# Altium schematic sheet Power Supply.SchDoc: Power supply Unit
size A; SheetNumber: 4; SheetTotal: 4
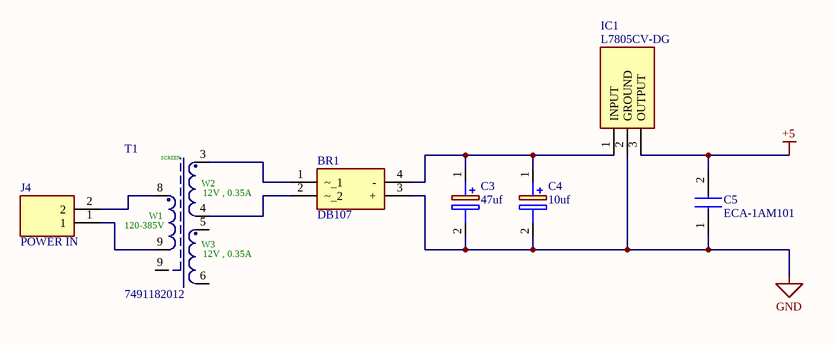
[diagram p0: Power Supply.SchDoc]

## Parts
BR1  DB107  [DIP825W50P510L830H340Q4N]
C3  47uf  [CAPPRD250W55D630H1220]
C4  10uf  [CAPPRD200W55D500H1200]
C5  ECA-1AM101  [CAPPRD200W55D525H1200]
IC1  L7805CV-DG  [TO255P460X1020X2008-3P]
J4  POWER IN  [TB00250002BE]
T1  7491182012  [EE16_7_4 (E16)]

## Nets
+5: C5.2(-) IC1.3(OUTPUT)
GND: BR1.3(+) C3.2(-) C4.2(-) C5.1(+) IC1.2(GROUND)
NetBR1_1: BR1.1(~_1) T1.3
NetBR1_2: BR1.2(~_2) T1.4
NetBR1_4: BR1.4(-) C3.1(+) C4.1(+) IC1.1(INPUT)
NetJ4_1: J4.1 T1.9
NetJ4_2: J4.2 T1.8

Not connected (* = marked no-connect by the designer): T1 5 6

## Notes on the sheet
- (in symbol CMP-1471-00001-1) SCREEN; W2; 12V , 0.35A; W1; 120-385V; W3

## Library data of the parts
BR1 = DB107: Bridge Rectifier; Manufacturer_Name: Rectron; Datasheet Link: https://www.rectron.com/data_sheets/db101-107.pdf; Height: 3.4mm; Manufacturer_Part_Number: DB107; Mouser Part Number: 583-DB107; Mouser Price/Stock: https://www.mouser.co.uk/ProductDetail/Rectron/DB107?qs=G5AQjGfRJcLGAY%252B6bEDnbw%3D%3D
C3 = ECE-A1EN470UB: Capacitor Polarised; Manufacturer_Name: Panasonic; Datasheet Link: http://industrial.panasonic.com/cdbs/www-data/pdf/RDF0000/ABA0000C1053.pdf; Height: 12.2mm; Manufacturer_Part_Number: ECE-A1EN470UB; Mouser Part Number: 667-ECE-A1EN470UB; Mouser Price/Stock: https://www.mouser.co.uk/ProductDetail/Panasonic/ECE-A1EN470UB?qs=rMMd5vBiahp%252B1Xr0dP1Lmg%3D%3D
C4 = ECA-1EM100: Capacitor Polarised; Manufacturer_Name: Panasonic; Datasheet Link: https://componentsearchengine.com/Datasheets/2/ECA-1EM100.pdf; Height: 12mm; Manufacturer_Part_Number: ECA-1EM100; Mouser Part Number: 667-ECA-1EM100; Mouser Price/Stock: https://www.mouser.com/Search/Refine.aspx?Keyword=667-ECA-1EM100; Arrow Part Number: ECA-1EM100; Arrow Price/Stock: https://www.arrow.com/en/products/eca1em100/panasonic
C5 = ECA-1AM101: Capacitor; Manufacturer_Name: Panasonic; Datasheet Link: http://uk.rs-online.com/web/p/products/8073233; Height: 12mm; Manufacturer_Part_Number: ECA-1AM101; Mouser Part Number: 667-ECA-1AM101; Mouser Price/Stock: https://www.mouser.co.uk/ProductDetail/Panasonic/ECA-1AM101?qs=o8jAzVTWolupLSuBsMrKhQ%3D%3D; Arrow Part Number: ECA-1AM101; Arrow Price/Stock: https://www.arrow.com/en/products/eca-1am101/panasonic?region=nac
IC1 = L7805CV-DG: Integrated Circuit; Manufacturer_Name: STMicroelectronics; Datasheet Link: http://www.st.com/web/en/resource/technical/document/datasheet/CD00000444.pdf; Height: 4.6mm; Manufacturer_Part_Number: L7805CV-DG; Mouser Part Number: 511-L7805CV-DG; Mouser Price/Stock: https://www.mouser.co.uk/ProductDetail/STMicroelectronics/L7805CV-DG?qs=T%2FOtf55vL7c3O0as9P9fAw%3D%3D; Arrow Part Number: L7805CV-DG; Arrow Price/Stock: https://www.arrow.com/en/products/l7805cv-dg/stmicroelectronics?region=europe
J4 = TB002-500-02BE: Connector; Manufacturer_Name: CUI Devices; Datasheet Link: https://eu.mouser.com/datasheet/2/670/tb002_500-1550579.pdf; Height: 10.4mm; Manufacturer_Part_Number: TB002-500-02BE; Mouser Part Number: 490-TB002-500-02BE; Mouser Price/Stock: https://www.mouser.co.uk/ProductDetail/CUI-Devices/TB002-500-02BE?qs=vLWxofP3U2x9716kcgva%2Fw%3D%3D; Arrow Part Number: TB002-500-02BE; Arrow Price/Stock: https://www.arrow.com/en/products/tb002-500-02be/cui-devices?region=nac
T1 = CMP-1471-00001-1: Off-Line Transformer WE-UNIT , L=0.9mH; Manufacturer: Wuerth Elektronik; Turns Ratio: "9.5","1:1"; Inductance: 0.9mH; Output Voltage (DC): 12; Output Current (A): 0.6; Input Voltage (AC): 85-265; ComponentLink1Description: Manufacturer URL; ComponentLink1URL: http://www.we-online.com; PackageReference: EE16_7_4 (E16); ComponentLink2Description: Datasheet; ComponentLink2URL: http://www.we-online.de/katalog/media/pdf/7491182012.pdf; PartNumber: 7491182012